# EasyEDA schematic SCH_Flexihal Direct-Plug Driver to RJ45 adapter_2023-12-17.json
TITLE: Sheet_1; REV: 1.0; Date: 2022-07-09; Sheet: 1/1; Drawn By: Edward Niedziejko; Company: Your Company
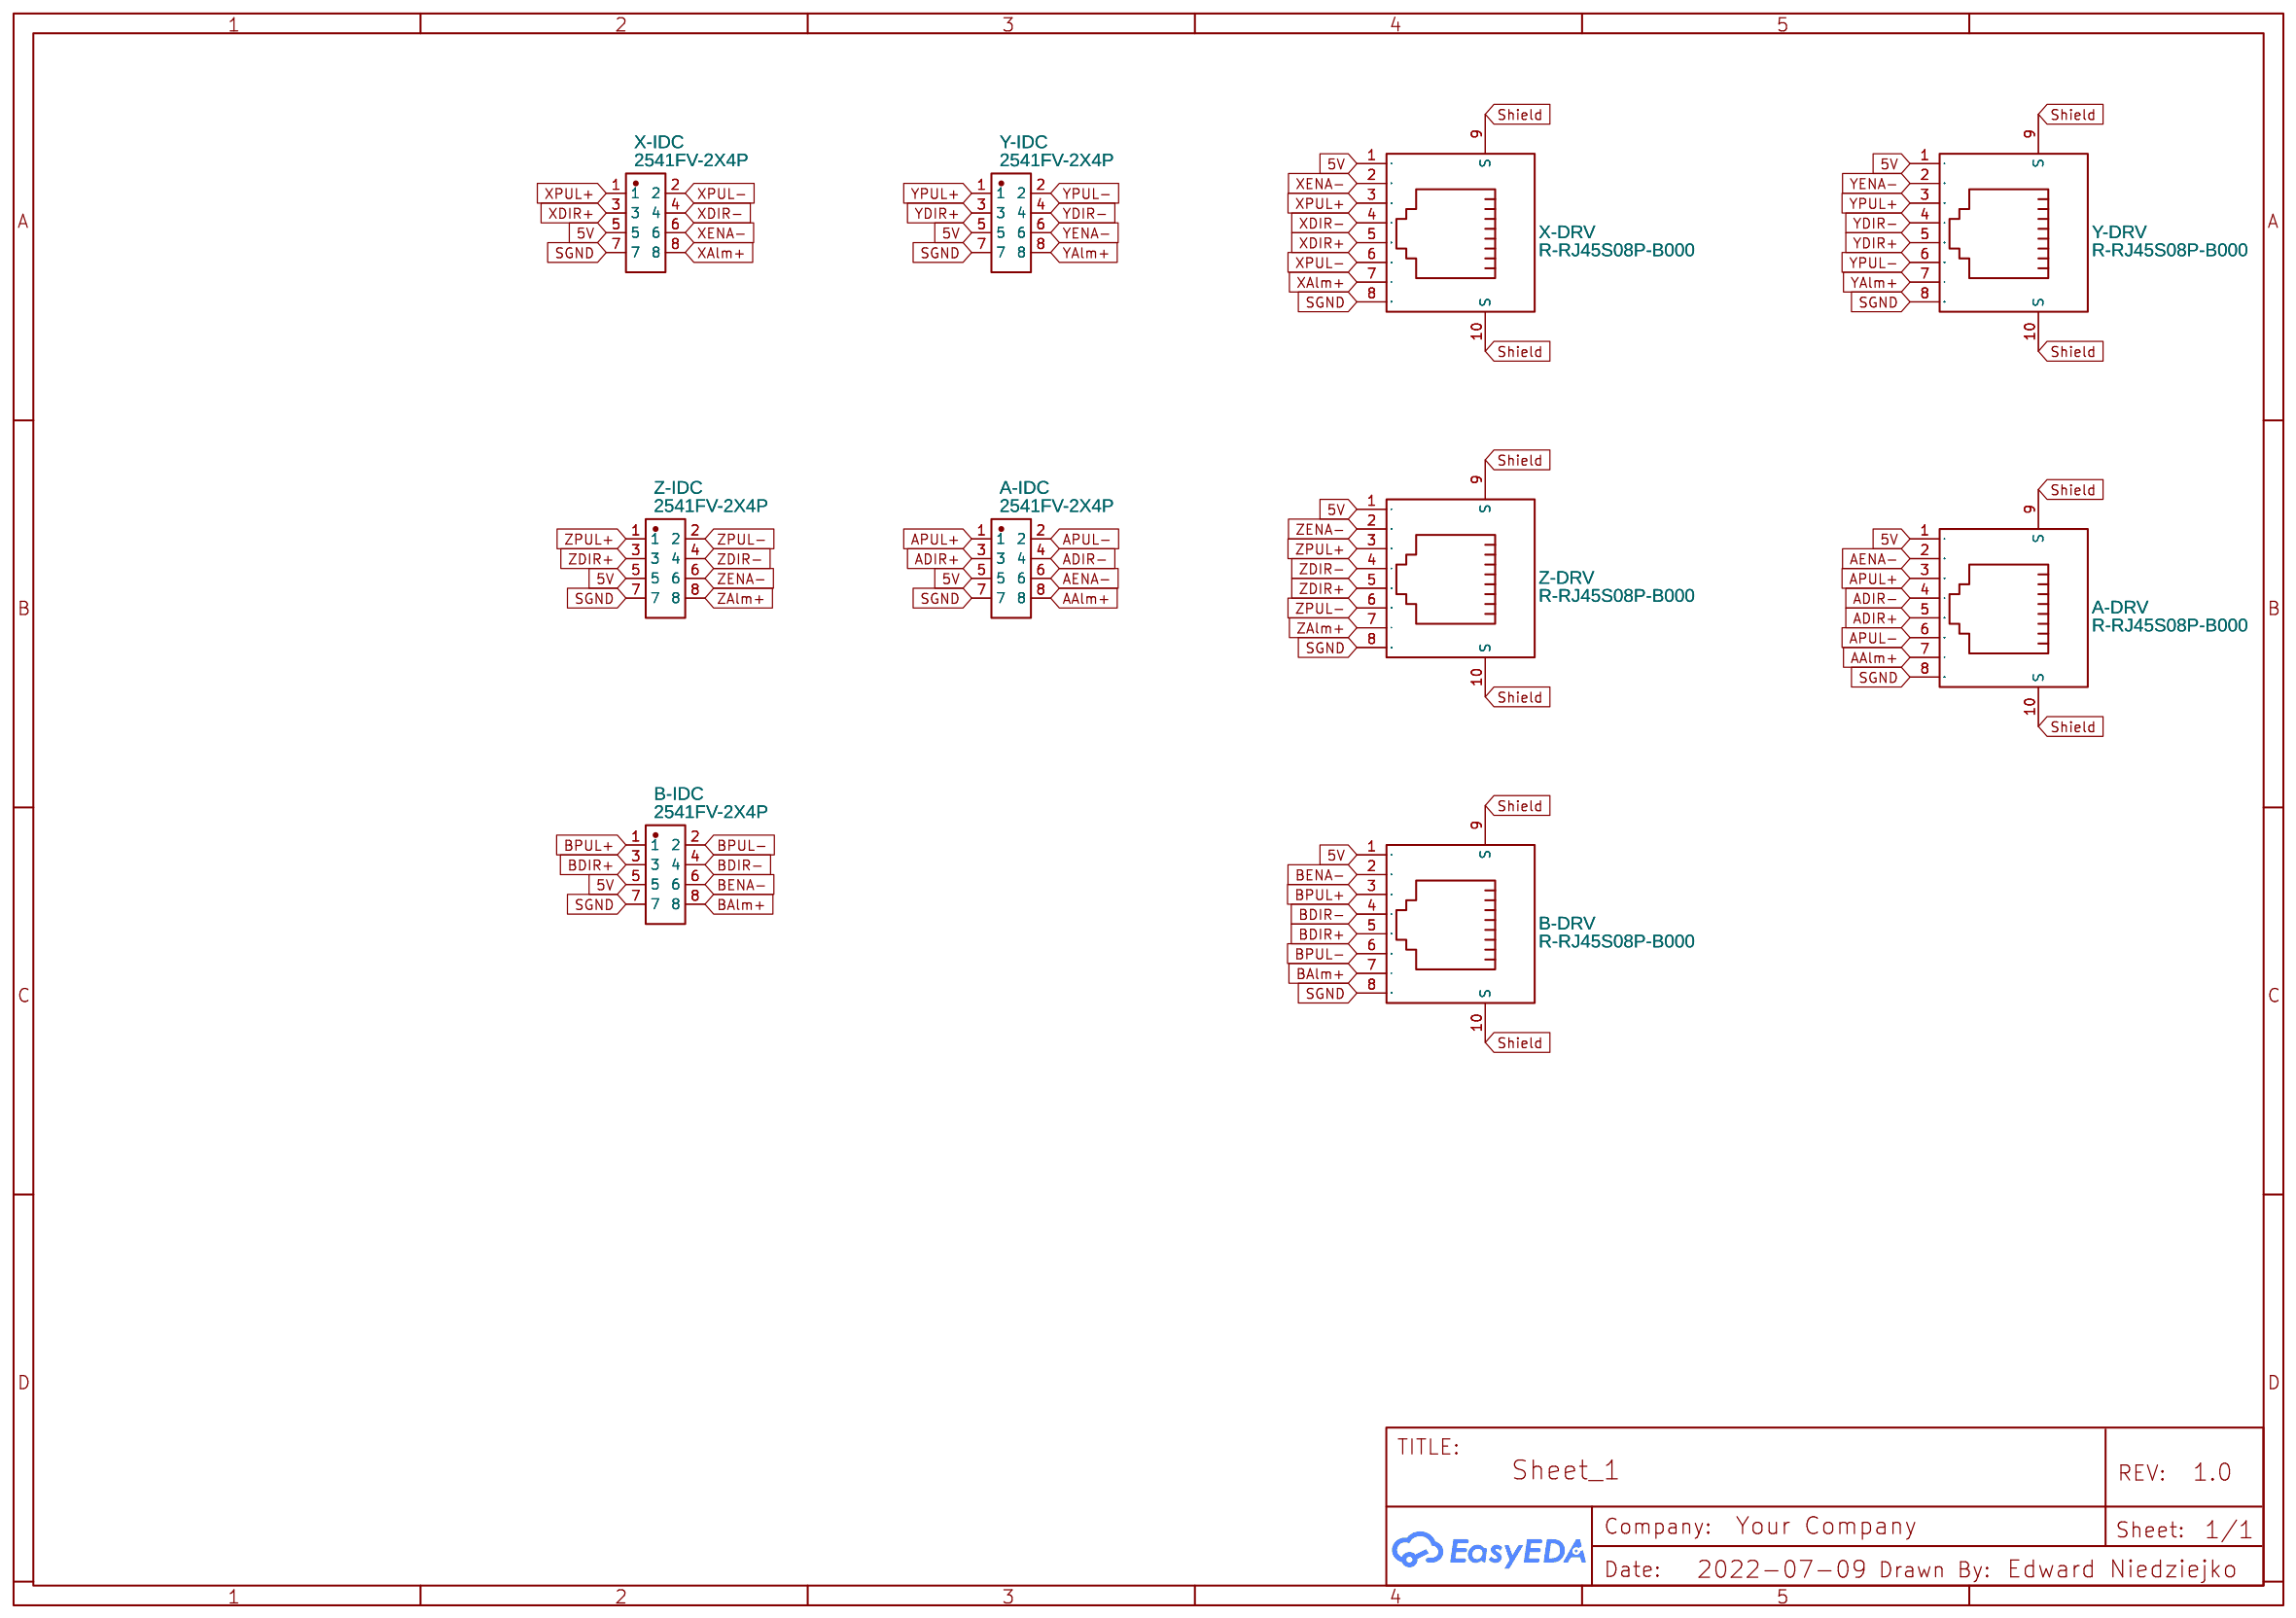
[diagram p0: schematic sheet]

## Parts
A-DRV  R-RJ45S08P-B000  [RJ45-TH_R-RJ45S08P-B000]
A-IDC  2541FV-2X4P  [HDR-TH_8P-P2.54-V-F-R2-C4-S2.54]
B-DRV  R-RJ45S08P-B000  [RJ45-TH_R-RJ45S08P-B000]
B-IDC  2541FV-2X4P  [HDR-TH_8P-P2.54-V-F-R2-C4-S2.54]
X-DRV  R-RJ45S08P-B000  [RJ45-TH_R-RJ45S08P-B000]
X-IDC  2541FV-2X4P  [HDR-TH_8P-P2.54-V-F-R2-C4-S2.54]
Y-DRV  R-RJ45S08P-B000  [RJ45-TH_R-RJ45S08P-B000]
Y-IDC  2541FV-2X4P  [HDR-TH_8P-P2.54-V-F-R2-C4-S2.54]
Z-DRV  R-RJ45S08P-B000  [RJ45-TH_R-RJ45S08P-B000]
Z-IDC  2541FV-2X4P  [HDR-TH_8P-P2.54-V-F-R2-C4-S2.54]

## Library data of the parts
A-DRV B-DRV X-DRV Y-DRV Z-DRV = R-RJ45S08P-B000: Contributor: LCSC; Supplier: LCSC; Supplier Part: C386763; Manufacturer: Ckmtw(灿科盟); JLCPCB Part Class: Extended Part; link: https://lcsc.com/eda_search?q=C386763&%26type=1&ref=editor
A-IDC B-IDC X-IDC Y-IDC Z-IDC = 2541FV-2X4P: Supplier: LCSC; Supplier Part: C18723055; Manufacturer: HanElectricity(瀚源); Manufacturer Part: 2541FV-2x4P; Contributor: lcsc; link: https://lcsc.com/eda_search?q=C18723055&%26type=1&ref=editor

## Nets
5V: A-DRV.1 A-IDC.5 B-DRV.1 B-IDC.5 X-DRV.1 X-IDC.5 Y-DRV.1 Y-IDC.5 Z-DRV.1 Z-IDC.5
SGND: A-DRV.8 A-IDC.7 B-DRV.8 B-IDC.7 X-DRV.8 X-IDC.7 Y-DRV.8 Y-IDC.7 Z-DRV.8 Z-IDC.7
AAlm+: A-DRV.7 A-IDC.8
ADIR+: A-DRV.5 A-IDC.3
ADIR-: A-DRV.4 A-IDC.4
AENA-: A-DRV.2 A-IDC.6
APUL+: A-DRV.3 A-IDC.1
APUL-: A-DRV.6 A-IDC.2
BAlm+: B-DRV.7 B-IDC.8
BDIR+: B-DRV.5 B-IDC.3
BDIR-: B-DRV.4 B-IDC.4
BENA-: B-DRV.2 B-IDC.6
BPUL+: B-DRV.3 B-IDC.1
BPUL-: B-DRV.6 B-IDC.2
Shield: A-DRV.9(S) A-DRV.10(S) B-DRV.9(S) B-DRV.10(S) X-DRV.9(S) X-DRV.10(S) Y-DRV.9(S) Y-DRV.10(S) Z-DRV.9(S) Z-DRV.10(S)
XAlm+: X-DRV.7 X-IDC.8
XDIR+: X-DRV.5 X-IDC.3
XDIR-: X-DRV.4 X-IDC.4
XENA-: X-DRV.2 X-IDC.6
XPUL+: X-DRV.3 X-IDC.1
XPUL-: X-DRV.6 X-IDC.2
YAlm+: Y-DRV.7 Y-IDC.8
YDIR+: Y-DRV.5 Y-IDC.3
YDIR-: Y-DRV.4 Y-IDC.4
YENA-: Y-DRV.2 Y-IDC.6
YPUL+: Y-DRV.3 Y-IDC.1
YPUL-: Y-DRV.6 Y-IDC.2
ZAlm+: Z-DRV.7 Z-IDC.8
ZDIR+: Z-DRV.5 Z-IDC.3
ZDIR-: Z-DRV.4 Z-IDC.4
ZENA-: Z-DRV.2 Z-IDC.6
ZPUL+: Z-DRV.3 Z-IDC.1
ZPUL-: Z-DRV.6 Z-IDC.2
